# Altium project DC-DC Senior Project.PrjPcb (part 2 of 2)

## Sheet System Input.SchDoc
size A
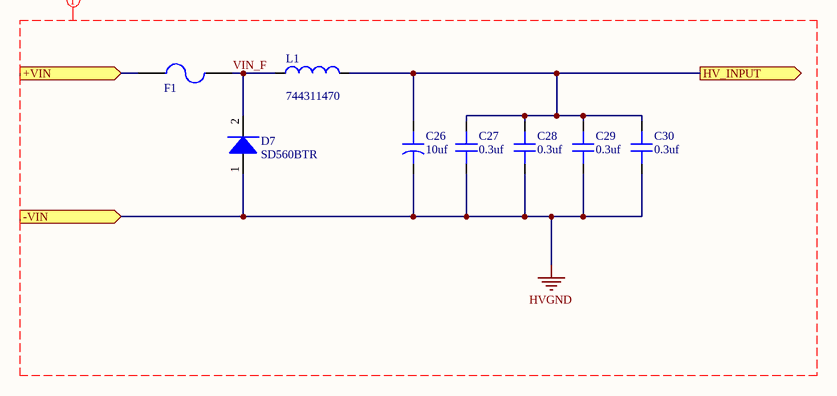
[diagram p8: System Input.SchDoc]

### Parts
C26  value 10uf  [CAP AL TH D10 L5 H30]  (hidden comment: Capacitor Electrolytic 10uf 500V CAP D10_31.5)
C27  value 0.3uf  [CAP 1812/4532 2.8MM]  (hidden comment: Capacitor MLCC 0.3uf 630V CAP 1812/4532)
C28  value 0.3uf  [CAP 1812/4532 2.8MM]  (hidden comment: Capacitor MLCC 0.3uf 630V CAP 1812/4532)
C29  value 0.3uf  [CAP 1812/4532 2.8MM]  (hidden comment: Capacitor MLCC 0.3uf 630V CAP 1812/4532)
C30  value 0.3uf  [CAP 1812/4532 2.8MM]  (hidden comment: Capacitor MLCC 0.3uf 630V CAP 1812/4532)
D7  SD560BTR  [DO214AA_ SD560BTR]
F1  Fuse  [04853,15DR]  (value not drawn)
L1  (no value)  [744311470]

### Ports
+VIN (in), -VIN (in), HV_INPUT (out)

### Nets
HV+: F1.1 ; port +VIN
HV_IN: C26.1 C27.2 C28.2 C29.2 C30.2 L1.2 ; port HV_INPUT
HVGND: C26.2 C27.1 C28.1 C29.1 C30.1 D7.1(A) ; port -VIN
VIN_F: D7.2(K) F1.2 L1.1

### Layout directives
net class HV: HVGND, VIN_F

### Library data of the parts
C26 = 1093: 10µF 500V Aluminum Electrolytic Capacitors Radial, Can  8000 Hrs @ 105°C; Manufacturer_id: 1; MfrPartNo: EKXJ501ELL100MJ30S; idCapacitor: 1093; Name: Cap_10uf_500V_CAP D10_31.5; Created_By: Nick Mah; Supplier 1: Digi-Key; Supplier Part Number 1: 565-4930-ND; Drawer_id: 1; Voltage_Rating: 500V; Dielectric: Electrolytic; Package: TH D10_31.5; Link: https://www.digikey.com/product-detail/en/united-chemi-con/EKXJ501ELL100MJ30S/565-4930-ND/7809906; ComponentLink1Description: Datasheet; ComponentLink1URL: http://www.chemi-con.com/upload/files/7/6/113326760852d6c4ba03a36.pdf
C27-C30 = 1089: Null; Manufacturer_id: 1; MfrPartNo: C4532X7T2J304K250KA; idCapacitor: 1089; Name: Cap_0.3uf_630V_CAP 1812/4532; Dielectric: Ceramic; Tolerance: 10%; Created_By: Jason Zhou; Supplier 1: Digi-Key; Supplier Part Number 1: 445-13458-1-ND; Drawer_id: 1; Voltage_Rating: 630V; Package: CAP 1812/4532; Link: https://www.digikey.com/product-detail/en/tdk-corporation/C4532X7T2J304K250KA/445-13458-1-ND/3955124; ComponentLink1Description: Datasheet; ComponentLink1URL: https://product.tdk.com/info/en/catalog/datasheets/mlcc_commercial_midvoltage_en.pdf; Created_Date: 4/10/2019
D7 = 18: Diode Standard 600V 5A Surface Mount SMB; Manufacturer_id: 1; idDiode: 18; Value: 1.2V @ 5A; Created_By: Jason Zhou; mfrpartno: SD560BTR; Drawer_id: 1; Name: SD560BTR; Type: Standard; Num_Circuits: 1; Ic: 5A; Package: SMB; Link: https://www.digikey.com/product-detail/en/smc-diode-solutions/SD560BTR/1655-1530-1-ND/6022975; ComponentLink1Description: Datasheet; ComponentLink1URL: http://www.smc-diodes.com/propdf/SD560B%20N1412%20REV.D.pdf; Supplier1: Digi-Key; Supplier1PartNo: 1655-1530-1-ND; Created_Date: 4/26/2019
F1 = 10: Manufacturer_id: 1; MfrPartNo: 04853.15DR; idFuse: 10; Value: 3.15A; I_max: 6.3A; V_max: 600VDC; Created_By: Jason Zhou; Drawer_id: 1; Name: 04853,15DR; I_hold: 3.15A; Link: https://www.digikey.com/product-detail/en/littelfuse-inc/04853.15DR/F5925CT-ND/3911051; Created_Date: 4/11/2019
L1 = 6: 4.7uH Wirewound Inductor 6A 19.5 mOhm Nonstandard; Manufacturer_id: 1; idInductor: 6; Tolerance: 20%; DC_Resistance: 0.0195; SRF: 33MHz; Created_By: Jason Zhou; MfrPartNo: 744311470; Drawer_id: 1; Name: 744311470; Value: 4.7uH; Current_Rating: 6A; Package: Nonstandard; Link: https://www.digikey.com/product-detail/en/wurth-electronics-inc/744311470/732-1153-1-ND/1639214; ComponentLink1Description: Datasheet; ComponentLink1URL: https://katalog.we-online.de/pbs/datasheet/744311470.pdf; Supplier1: Digi-Key; Supplier1PartNo: 732-1153-1-ND; Created_Date: 4/11/2019

## Sheet Enable SSR.SchDoc
size A
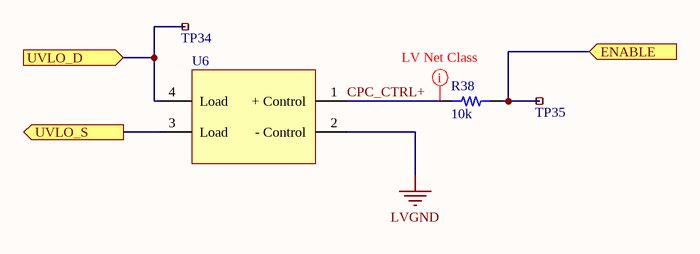
[diagram p9: Enable SSR.SchDoc]

### Parts
R38  value 10k  [RES 0603/1608]  (hidden comment: Resistor 10k 0603 1/10W 1%)
TP34  RCU-0C  [5029]  (value not drawn)
TP35  RCU-0C  [5029]  (value not drawn)
U6  (no value)  [CPC1393GR]

### Ports
ENABLE (in), UVLO_D (in), UVLO_S (out)

### Nets
LVGND: U6.2(-_Control)
CPC_CTRL+: R38.1 U6.1(+_Control)
HV_IN_R: TP34.1 U6.4(Load) ; port UVLO_D
SSR_ENABLE: R38.2 TP35.1 ; port ENABLE
UVLO_Vsec: U6.3(Load) ; port UVLO_S

### Layout directives
net class LV: CPC_CTRL+

### Library data of the parts
R38 = 313: Manufacturer_id: 1; idResistor: 313; Name: Res_10k_0603_1/10W_1%; Created_By: Nick Mah; Supplier 1: Digi-Key; Drawer_id: 1; Tolerance: 1%; Power: 1/10W; Package: 0603; ComponentLink1Description: Datasheet; Created_Date: 2018-10-20
TP34 TP35 = 28: Test point; Manufacturer_id: 1; idConn: 28; Value: CONN; Created_By: Jason Zhou; Drawer_id: 1; Name: 5029; Num_Contacts: 1; Num_Rows: 1; Package: 5029; MfrPartNo: 5029; Link: https://www.digikey.com/product-detail/en/keystone-electronics/5029/36-5029CT-ND/5980631; ComponentLink1Description: Datasheet; ComponentLink1URL: file:///C:/Users/Jason%20Zhou/Downloads/5029.PDF; Supplier1: Digi-Key; Supplier1PartNo: 36-5029CT-ND; Created_Date: 4/26/2019
U6 = 26: Solid State Relay SPST-NO (1 Form A) 4-SMD (0.300", 7.62mm); Manufacturer_id: 1; MfrPartNo: CPC1393GRTR; idIC_Misc: 26; Value: Null; Created_By: Lynette; Drawer_id: 1; Name: CPC1393; Type: Null; Protocol: Null; Num_Circuits: 1; Data_Rate: Null; Vin(Min): Null; Vin(Max): Null; Package: CPC1393GR; Link: https://www.digikey.com/product-detail/en/ixys-integrated-circuits-division/CPC1393GRTR/CLA270CT-ND/1277144; ComponentLink1Description: Null; ComponentLink1URL: Null; Supplier1: Null; Supplier1PartNo: Null; Updated_By: Null

## Nets that join several sheets
+12V_HC_HV: OptoIsolator (R41.2), LT3752-Main (R11.1 R16.1), Flyback Supply (C2.2 D2.1), Forward Active Supply (C10.2 U1.27), Gate Driver (R6.2)
+12V_HC_LV: LT8311-Main (5 pins), Flyback Supply (C1.2 D1.1)
+14V_OUT: DC-DC Converter (X2.1), LT8311-Main (C20.2 R34.2), Forward Active Supply (6 pins)
HV+: DC-DC Converter (X1.1), System Input (F1.1)
HV_IN: LT3752-Main (R15.2 R17.1), Flyback Supply (T1.1), Forward Active Supply (6 pins), System Input (6 pins)
HVGND: DC-DC Converter (X1.2), Sync Transformer (T3.3), OptoIsolator (C24.1), LT3752-Main (10 pins), Flyback Supply (C2.1 R1.1 T1.5), Forward Active Supply (R5.1), Gate Driver (R10.1), System Input (6 pins)
LVGND: DC-DC Converter (X3.1), Sync Transformer (R43.1 T3.4), OptoIsolator (U5.2), LT8311-Main (11 pins), Flyback Supply (C1.1 T1.7), Forward Active Supply (9 pins), Enable SSR (U6.2)
Cch_Drive: LT8311-Main (TP24.1 U4.16), Forward Active Supply (M3.1 M3.4)
Cch_Gate: Forward Active Supply (M5.1 TP2.1), Gate Driver (C13.2 R7.2 R8.2)
Cch_I_Sense: LT8311-Main (R33.2), Forward Active Supply (M3.3 M3.6 R3.2)
Clp_Gate: LT3752-Main (TP11.1 U3.32), Gate Driver (R9.1)
Fwd_Drive: LT8311-Main (TP27.1 U4.5), Forward Active Supply (M2.4)
HV_IN_R: LT3752-Main (R17.2), Enable SSR (TP34.1 U6.4)
Opto_In: OptoIsolator (U5.3), LT3752-Main (R23.2 R25.2 TP18.1)
OPTO_OUT: OptoIsolator (R42.1), LT8311-Main (TP31.1 U4.9)
Pri_Current_Sense: LT3752-Main (R18.2 R20.2 TP16.1), Forward Active Supply (20 pins)
Pri_Drain_SWP: Forward Active Supply (15 pins), Gate Driver (C13.1 C14.1 R8.1 U2.6)
Pri_Gate: LT3752-Main (TP13.1 U3.24), Forward Active Supply (U1.31)
Q2_D: LT3752-Main (R14.2 TP9.1), Flyback Supply (M1.3 R1.2)
Q2_G: LT3752-Main (TP10.1 U3.34), Flyback Supply (M1.1)
SSR_ENABLE: DC-DC Converter (X1.4), Enable SSR (R38.2 TP35.1)
SYNC_IN: Sync Transformer (C25.1), LT3752-Main (TP21.1 U3.30)
SYNC_OUT: Sync Transformer (R43.2 T3.6), LT8311-Main (TP30.1 U4.15)
UVLO_Vsec: LT3752-Main (R21.2 TP15.1 U3.9), Enable SSR (U6.3)